# EAGLE schematic avocado_v2.0 (EAGLE 8.6.0)
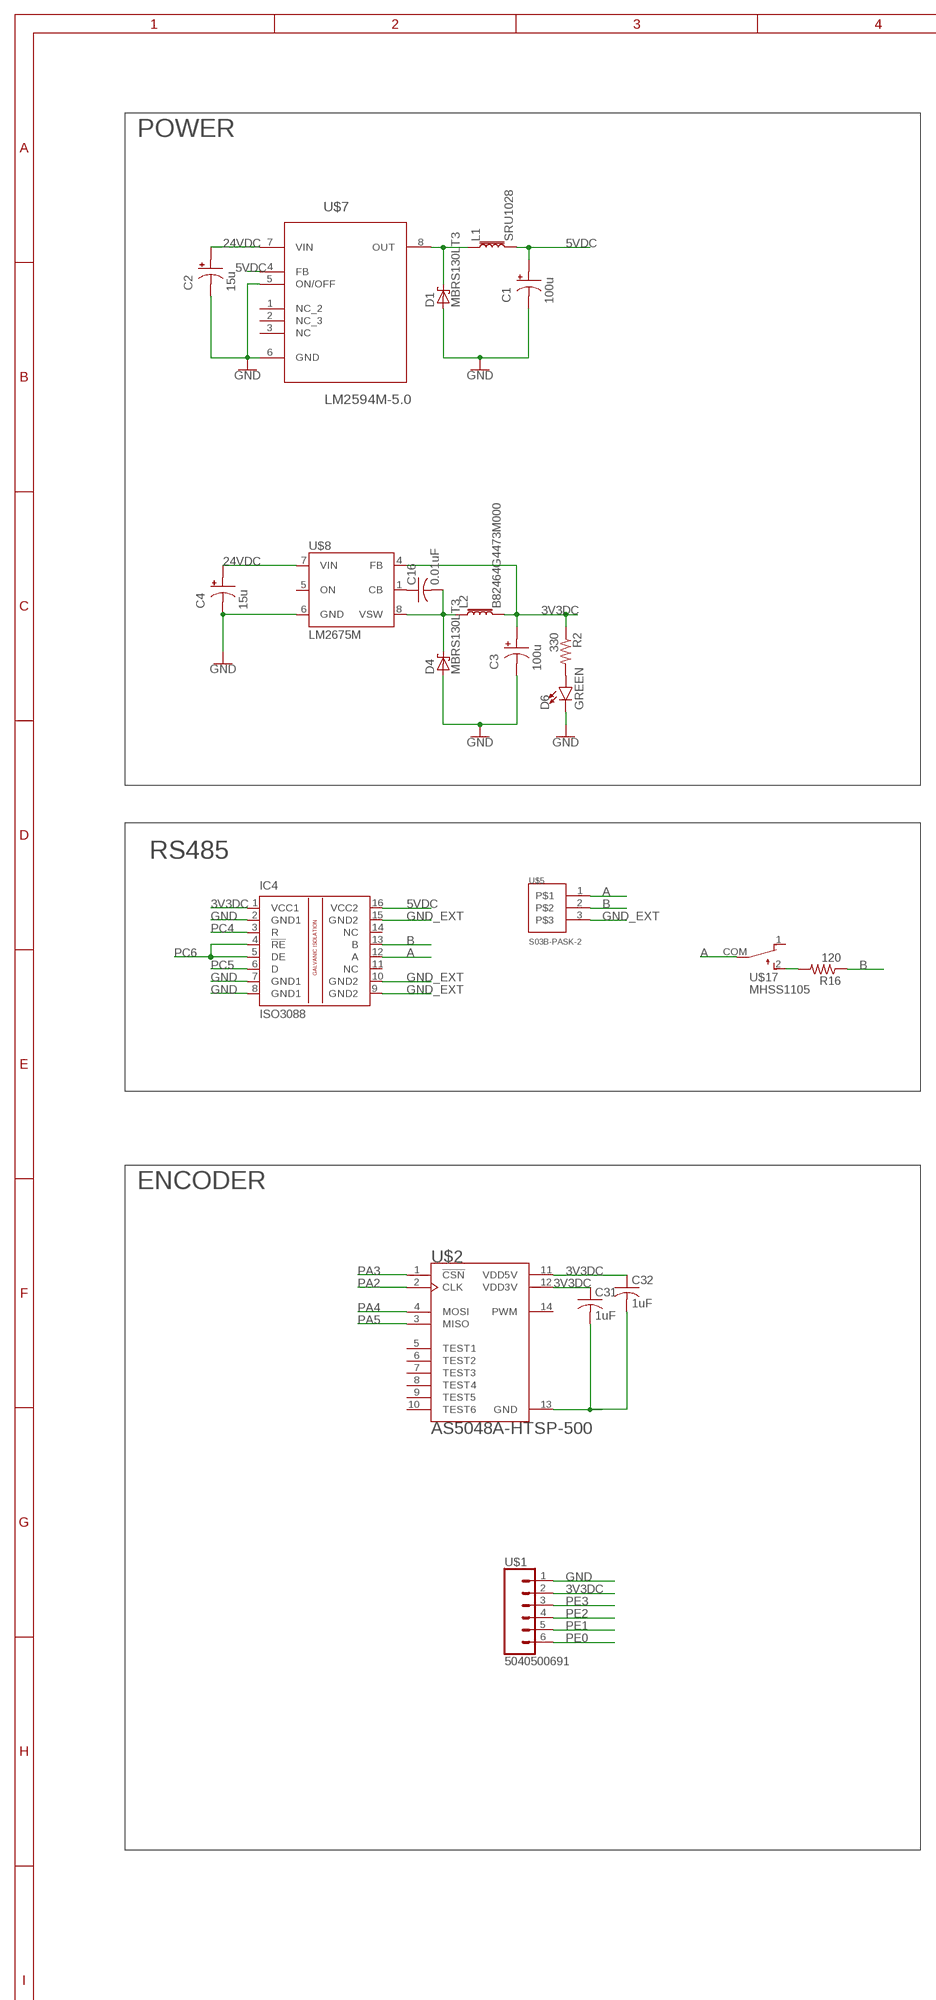
[diagram p0: schematic, sheet 1, part 1 of 2]
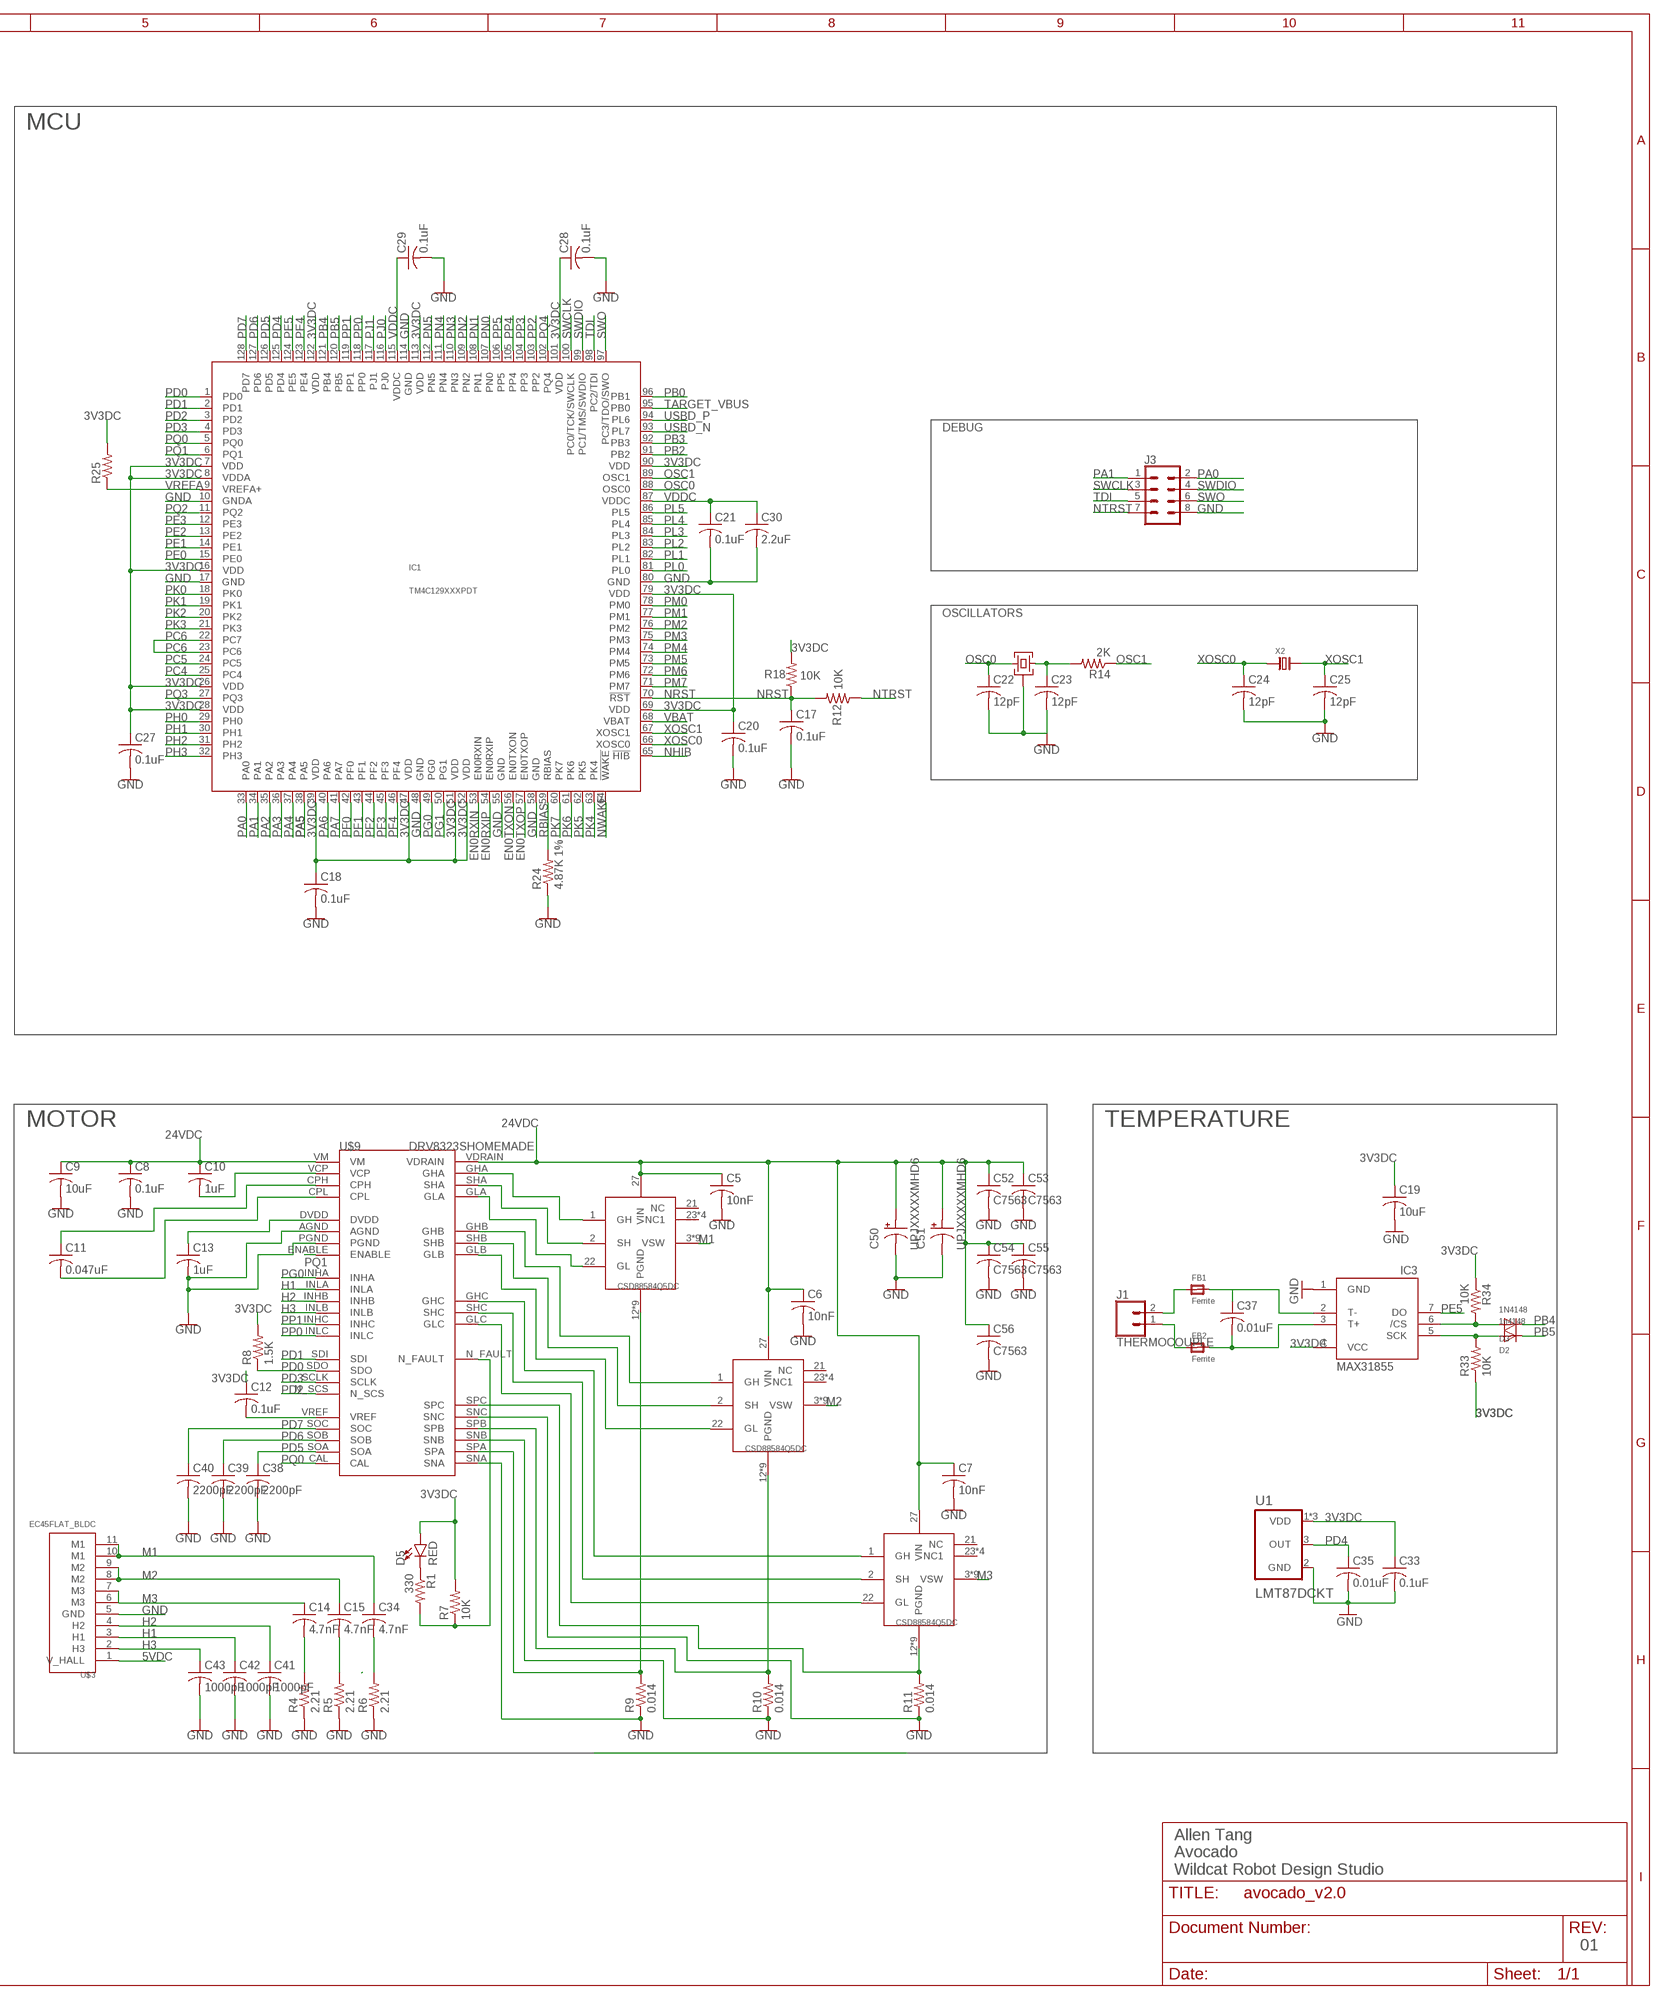
[diagram p1: schematic, sheet 1, part 2 of 2]

## Parts
C1  100u  AVX_TPS_CAPD  [2917-D]
C2  15u  AVX_TPS_CAPD  [2917-D]
C3  100u  AVX_TPS_CAPD  [2917-D]
C4  15u  AVX_TPS_CAPD  [2917-D]
C5  10nF  C-USC0402  [C0402]
C6  10nF  C-USC0402  [C0402]
C7  10nF  C-USC0402  [C0402]
C8  0.1uF  C-USC0402  [C0402]
C9  10uF  C-USC0805  [C0805]
C10  1uF  C-USC0805  [C0805]
C11  0.047uF  C-USC0402  [C0402]
C12  0.1uF  C-USC0402  [C0402]
C13  1uF  C-USC0402  [C0402]
C14  4.7nF  C-USC0402  [C0402]
C15  4.7nF  C-USC0402  [C0402]
C16  0.01uF  C-USC0402  [C0402]
C17  0.1uF  C-USC0402  [C0402]
C18  0.1uF  C-USC0402  [C0402]
C19  10uF  C-USC0402  [C0402]
C20  0.1uF  C-USC0402  [C0402]
C21  0.1uF  C-USC0402  [C0402]
C22  12pF  C-USC0402  [C0402]
C23  12pF  C-USC0402  [C0402]
C24  12pF  C-USC0402  [C0402]
C25  12pF  C-USC0402  [C0402]
C27  0.1uF  C-USC0402  [C0402]
C28  0.1uF  C-USC0402  [C0402]
C29  0.1uF  C-USC0402  [C0402]
C30  2.2uF  C-USC0402  [C0402]
C31  1uF  C-USC0805  [C0805]
C32  1uF  C-USC0805  [C0805]
C33  0.1uF  C-USC0402  [C0402]
C34  4.7nF  C-USC0402  [C0402]
C35  0.01uF  C-USC0402  [C0402]
C37  0.01uF  C-USC0402  [C0402]
C38  2200pF  C-USC0402  [C0402]
C39  2200pF  C-USC0402  [C0402]
C40  2200pF  C-USC0402  [C0402]
C41  1000pF  C-USC0402  [C0402]
C42  1000pF  C-USC0402  [C0402]
C43  1000pF  C-USC0402  [C0402]
C50  UPJXXXXXMHD6  [UPJXXXXXMHD6]
C51  UPJXXXXXMHD6  [UPJXXXXXMHD6]
C52  C7563  [3025]
C53  C7563  [3025]
C54  C7563  [3025]
C55  C7563  [3025]
C56  C7563  [3025]
D1  MBRS130LT3  [SMB]
D2  1n4148  DIODESOD-323F  [SOD-323F]
D3  1N4148  DIODESOD-323F  [SOD-323F]
D4  MBRS130LT3  [SMB]
D5  RED  LED-RED0603  [LED-0603]
D6  GREEN  LED-GREEN0603  [LED-0603]
FB1  Ferrite  FERRITE_0805  [_0805]
FB2  Ferrite  FERRITE_0805  [_0805]
IC1  TM4C129XXXPDT  [PDT_S-PQFP-G128]
IC3  MAX31855  MAX6675  [SO08]
IC4  ISO3088  [SOIC16]
J1  THERMOCOUPLE  [2_SMP]
J3  CONN_04X2  [2X4]
L1  SRU1028  [SRU1028]
L2  B82464G4473M000  [B82464G4473M000]
R1  330  R-US_R0402  [R0402]
R2  330  R-US_R0402  [R0402]
R4  2.21  R-US_R0805  [R0805]
R5  2.21  R-US_R0805  [R0805]
R6  2.21  R-US_R0805  [R0805]
R7  10K  R-US_R0402  [R0402]
R8  1.5K  R-US_R0402  [R0402]
R9  0.014  R-US_R2512  [R2512]
R10  0.014  R-US_R2512  [R2512]
R11  0.014  R-US_R2512  [R2512]
R12  10K  R-US_R0402  [R0402]
R14  2K  R-US_R0402  [R0402]
R16  120  R-US_R0805  [R0805]
R18  10K  R-US_R0402  [R0402]
R24  4.87K 1%  R-US_R0402  [R0402]
R25  R-US_R0402  [R0402]
R33  10K  R-US_R0402  [R0402]
R34  10K  R-US_R0402  [R0402]
U1  LMT87DCKT  [SOT65P210X110-5N]
U$1  5040500691  [5040500691]
U$2  AS5048A-HTSP-500  [SOP65P640X120-14N]
U$3  EC45FLAT_BLDC  [1MM-FPC-11PIN]
U$4  NX3225GA  [NX3225GA]
U$5  S03B-PASK-2  [S03B-PASK-2]
U$7  LM2594M-5.0  [SOIC127P620X175-8N]
U$8  LM2675M  [SO08]
U$9  DRV8323SHOMEMADE  [DRV8323S]
U$10  CSD88584Q5DC  [MOSFET_CSD88599Q5DC]
U$11  CSD88584Q5DC  [MOSFET_CSD88599Q5DC]
U$12  CSD88584Q5DC  [MOSFET_CSD88599Q5DC]
U$17  MHSS1105  [MHSS1105]
X2  CRYSTAL-ABS07  [ABRACON-ABS07-32.768KHZ]

## Nets
3V3DC: C3.+(A) C12.1 C18.1 C19.1 C20.1 C27.1 C28.1 C31.1 C32.1 C33.1 D5.A IC1.7(VDD) IC1.8(VDDA) IC1.16(VDD) IC1.26(VDD) IC1.28(VDD) IC1.39(VDD) IC1.47(VDD) IC1.51(VDD) IC1.52(VDD) IC1.69(VDD) IC1.79(VDD) IC1.90(VDD) IC1.101(VDD) IC1.113(VDD) IC1.122(VDD) IC3.4(VCC) IC4.1(VCC1) L2.2 R2.1 R7.2 R8.2 R18.2 R25.2 R33.1 R34.1 U1.1(VDD) U1.4(VDD) U1.5(VDD) U$1.2 U$2.11(VDD5V) U$2.12(VDD3V) U$8.4(FB)
5VDC: C1.+(A) IC4.16(VCC2) L1.2 U$3.1(V_HALL) U$7.4(FB)
24VDC: C2.+(A) C4.+(A) C5.1 C6.1 C7.1 C8.1 C9.1 C10.1 C50.+(A) C51.+(A) C52.P$1 C53.P$1 C54.P$1 C55.P$1 C56.P$1 U$7.7(VIN) U$8.7(VIN) U$9.VDRAIN U$9.VM U$10.27(VIN) U$11.27(VIN) U$12.27(VIN)
A: IC4.12(A) U$5.1 U$17.COM
B: IC4.13(B) R16.1 U$5.2
CS: D3.A IC3.6(/CS) R34.2
DVDD: C13.1 U$9.DVDD
EN0RXIN: IC1.53(EN0RXIN)
EN0RXIP: IC1.54(EN0RXIP)
EN0TXON: IC1.56(EN0TXON)
EN0TXOP: IC1.57(EN0TXOP)
GH1: U$9.GHA U$12.1(GH)
GH2: U$9.GHB U$11.1(GH)
GH3: U$9.GHC U$10.1(GH)
GL1: U$9.GLA U$12.22(GL)
GL2: U$9.GLB U$11.22(GL)
GL3: U$9.GLC U$10.22(GL)
GND: C1.-(C) C2.-(C) C3.-(C) C4.-(C) C5.2 C6.2 C7.2 C8.2 C9.2 C13.2 C17.2 C18.2 C19.2 C20.2 C21.2 C23.2 C24.2 C25.2 C27.2 C28.2 C29.2 C30.2 C31.2 C32.2 C33.2 C35.2 C38.2 C39.2 C40.2 C41.2 C42.2 C43.2 C50.-(C) C51.-(C) C52.P$2 C53.P$2 C54.P$2 C55.P$2 C56.P$2 D1.A D4.A D6.C IC1.10(GNDA) IC1.17(GND) IC1.48(GND) IC1.55(GND) IC1.58(GND) IC1.80(GND) IC1.114(GND) IC3.1(GND) IC4.2(GND1) IC4.7(GND1) IC4.8(GND1) J3.8 R4.1 R5.1 R6.1 R9.1 R10.1 R11.1 R24.1 U1.2(GND) U$1.1 U$2.13(GND) U$3.5(GND) U$7.5(ON/OFF) U$7.6(GND) U$8.6(GND) U$9.AGND U$9.PGND U$9.SNA U$9.SNB U$9.SNC
GND_EXT: IC4.9(GND2) IC4.10(GND2) IC4.15(GND2) U$5.3
H1: C42.1 U$3.3(H1) U$9.INLA
H2: C41.1 U$3.4(H2) U$9.INHB
H3: C43.1 U$3.2(H3) U$9.INLB
ISENS1: R9.2 U$9.SPA U$12.12(PGND) U$12.13(PGND) U$12.14(PGND) U$12.15(PGND) U$12.16(PGND) U$12.17(PGND) U$12.18(PGND) U$12.19(PGND) U$12.20(PGND)
ISENS2: R10.2 U$9.SPB U$11.12(PGND) U$11.13(PGND) U$11.14(PGND) U$11.15(PGND) U$11.16(PGND) U$11.17(PGND) U$11.18(PGND) U$11.19(PGND) U$11.20(PGND)
ISENS3: R11.2 U$9.SPC U$10.12(PGND) U$10.13(PGND) U$10.14(PGND) U$10.15(PGND) U$10.16(PGND) U$10.17(PGND) U$10.18(PGND) U$10.19(PGND) U$10.20(PGND)
M1: C34.1 U$3.10(M1) U$3.11(M1) U$12.3(VSW) U$12.4(VSW) U$12.5(VSW) U$12.6(VSW) U$12.7(VSW) U$12.8(VSW) U$12.9(VSW) U$12.10(VSW) U$12.11(VSW)
M2: C15.1 U$3.8(M2) U$3.9(M2) U$11.3(VSW) U$11.4(VSW) U$11.5(VSW) U$11.6(VSW) U$11.7(VSW) U$11.8(VSW) U$11.9(VSW) U$11.10(VSW) U$11.11(VSW)
M3: C14.1 U$3.6(M3) U$3.7(M3) U$10.3(VSW) U$10.4(VSW) U$10.5(VSW) U$10.6(VSW) U$10.7(VSW) U$10.8(VSW) U$10.9(VSW) U$10.10(VSW) U$10.11(VSW)
N$1: C34.2 R6.2
N$2: C10.2 U$9.VCP
N$3: C11.1 U$9.CPH
N$4: C16.1 U$8.1(CB)
N$6: C11.2 U$9.CPL
N$7: D6.A R2.2
N$8: D5.C R1.1
N$13: FB1.1 J1.2
N$15: C37.1 FB1.2 IC3.2(T-)
N$16: FB2.1 J1.1
N$17: C37.2 FB2.2 IC3.3(T+)
N$22: C12.2 U$9.VREF
N$23: R16.2 U$17.2
N$24: D1.C L1.1 U$7.8(OUT)
N$25: C16.2 D4.C L2.1 U$8.8(VSW)
N$40: C14.2 R4.2
N$41: C15.2 R5.2
N$42: C22.2 U$4.P$2 U$4.P$4
N$45: C23.1 R14.2 U$4.P$3
NFAULT: R1.2 R7.1 U$9.N_FAULT
NHIB: IC1.65(!HIB)
NRST: C17.1 IC1.70(!RST) R12.2 R18.1
NTRST: J3.7 R12.1
NWAKE: IC1.64(!WAKE)
OSC0: C22.1 IC1.88(OSC0) U$4.P$1
OSC1: IC1.89(OSC1) R14.1
PA0: IC1.33(PA0) J3.2
PA1: IC1.34(PA1) J3.1
PA2: IC1.35(PA2) U$2.2(CLK)
PA3: IC1.36(PA3) U$2.1(!CSN)
PA4: IC1.37(PA4) U$2.4(MOSI)
PA5: IC1.38(PA5) U$2.3(MISO)
PA6: IC1.40(PA6)
PA7: IC1.41(PA7)
PB0: IC1.96(PB1)
PB2: IC1.91(PB2)
PB3: IC1.92(PB3)
PB4: D3.C IC1.121(PB4)
PB5: D2.C IC1.120(PB5)
PC4: IC1.25(PC4) IC4.3(R)
PC5: IC1.24(PC5) IC4.6(D)
PC6: IC1.22(PC7) IC1.23(PC6) IC4.4(!RE) IC4.5(DE)
PD0: IC1.1(PD0) R8.1 U$9.SDO
PD1: IC1.2(PD1) U$9.SDI
PD2: IC1.3(PD2) U$9.N_SCS
PD3: IC1.4(PD3) U$9.SCLK
PD4: C35.1 IC1.125(PD4) U1.3(OUT)
PD5: C38.1 IC1.126(PD5) U$9.SOA
PD6: C39.1 IC1.127(PD6) U$9.SOB
PD7: C40.1 IC1.128(PD7) U$9.SOC
PE0: IC1.15(PE0) U$1.6
PE1: IC1.14(PE1) U$1.5
PE2: IC1.13(PE2) U$1.4
PE3: IC1.12(PE3) U$1.3
PE4: IC1.123(PE4)
PE5: IC1.124(PE5) IC3.7(DO)
PF0: IC1.42(PF0)
PF1: IC1.43(PF1)
PF2: IC1.44(PF2)
PF3: IC1.45(PF3)
PF4: IC1.46(PF4)
PG0: IC1.49(PG0) U$9.INHA
PG1: IC1.50(PG1)
PH0: IC1.29(PH0)
PH1: IC1.30(PH1)
PH2: IC1.31(PH2)
PH3: IC1.32(PH3)
PJ0: IC1.116(PJ0)
PJ1: IC1.117(PJ1)
PK0: IC1.18(PK0)
PK1: IC1.19(PK1)
PK2: IC1.20(PK2)
PK3: IC1.21(PK3)
PK4: IC1.63(PK4)
PK5: IC1.62(PK5)
PK6: IC1.61(PK6)
PK7: IC1.60(PK7)
PL0: IC1.81(PL0)
PL1: IC1.82(PL1)
PL2: IC1.83(PL2)
PL3: IC1.84(PL3)
PL4: IC1.85(PL4)
PL5: IC1.86(PL5)
PM0: IC1.78(PM0)
PM1: IC1.77(PM1)
PM2: IC1.76(PM2)
PM3: IC1.75(PM3)
PM4: IC1.74(PM4)
PM5: IC1.73(PM5)
PM6: IC1.72(PM6)
PM7: IC1.71(PM7)
PN0: IC1.107(PN0)
PN1: IC1.108(PN1)
PN2: IC1.109(PN2)
PN3: IC1.110(PN3)
PN4: IC1.111(PN4)
PN5: IC1.112(PN5)
PP0: IC1.118(PP0) U$9.INLC
PP1: IC1.119(PP1) U$9.INHC
PP2: IC1.103(PP2)
PP3: IC1.104(PP3)
PP4: IC1.105(PP4)
PP5: IC1.106(PP5)
PQ0: IC1.5(PQ0) U$9.CAL
PQ1: IC1.6(PQ1) U$9.ENABLE
PQ2: IC1.11(PQ2)
PQ3: IC1.27(PQ3)
PQ4: IC1.102(PQ4)
RBIAS: IC1.59(RBIAS) R24.2
SCK: D2.A IC3.5(SCK) R33.2
SH1: U$9.SHA U$12.2(SH)
SH2: U$9.SHB U$11.2(SH)
SH3: U$9.SHC U$10.2(SH)
SWCLK: IC1.100(PC0/TCK/SWCLK) J3.3
SWDIO: IC1.99(PC1/TMS/SWDIO) J3.4
SWO: IC1.97(PC3/TDO/SWO) J3.6
TARGET_VBUS: IC1.95(PB0)
TDI: IC1.98(PC2/TDI) J3.5
USBD_N: IC1.93(PL7)
USBD_P: IC1.94(PL6)
VBAT: IC1.68(VBAT)
VDDC: C21.1 C29.1 C30.1 IC1.87(VDDC) IC1.115(VDDC)
VREFA: IC1.9(VREFA+) R25.1
XOSC0: C24.1 IC1.66(XOSC0) X2.P$1
XOSC1: C25.1 IC1.67(XOSC1) X2.P$2
Unconnected: IC4.11(NC) IC4.14(NC) U$2.5(TEST1) U$2.6(TEST2) U$2.7(TEST3) U$2.8(TEST4) U$2.9(TEST5) U$2.10(TEST6) U$2.14(PWM) U$7.1(NC_2) U$7.2(NC_3) U$7.3(NC) U$8.5(ON) U$10.21(NC) U$10.23(NC1) U$10.24(NC1) U$10.25(NC1) U$10.26(NC1) U$11.21(NC) U$11.23(NC1) U$11.24(NC1) U$11.25(NC1) U$11.26(NC1) U$12.21(NC) U$12.23(NC1) U$12.24(NC1) U$12.25(NC1) U$12.26(NC1) U$17.1

## Notes on the sheet
- POWER | MCU
- DEBUG
- OSCILLATORS
- RS485
- ENCODER | MOTOR | TEMPERATURE
- Allen Tang
  Avocado
  Wildcat Robot Design Studio
- 01

## Library data of the parts
C1-C4 = avocado:AVX_TPS_CAP: Tantalum Surface Mount Capacitor - Standard Tantalum
C5-C25 C27-C35 C37-C43 = rcl:C-US: CAPACITOR, American symbol; SPICEPREFIX: C
C50 C51 = avocado:UPJXXXXXMHD6: Aluminum Electrolytic Capacitor
C52-C56 = avocado:C7563: 22uF, 50V, Ceramic Capacitor, TDK
D1 D4 = avocado:MBRS130LT3: Schottky Power Rectifier Source: http://www.onsemi.com/pub/Collateral/MBRS130LT3-D.PDF
D2 D3 = adafruit:DIODE: Diode SMADIODE - SMA Surface Mount Package 20V 1A Schottky Diode Digikey: 641-1014-6-ND DO-1N4148 - Through Hole Small Current Diode SOD-123 20V 1 A (.5mV Vf) Schottky Diode - Digikey: MBRX120TPMSCT-ND SOD-323 10V 570mA (.38mV Vf, 3ns) Schottky Diode - Digikey: ZLLS410CT-ND SOD-523 30V 30mA Schottky Diode (RB751S-40TE61) - Digikey: RB751S-40TE61CT-ND SOT23-R/W - SOT23 Package (R = Solder Paste/Reflow Ovens, W = Hand-Soldering) BAT54Film 40V 300mA - Digikey: 497-7162-1-ND
D5 = SparkFun-LED:LED-RED: Red SMD LED Used in manufacturing of most products at SparkFun Packages: 0603 - SMD 0603 package [Product Link] <http://docs.avagotech.com/docs/AV02-0551EN> 0603 SMART - SMD 0603 SMART package ( more efficient and expensive)[Product Link] <http://www.osram-os.com/Graphics/XPic2/00077099_0.pdf> 1206 - SMD1206 package [Product Link] <https://www.sparkfun.com/datasheets/DevTools/LilyPad/Q150OVS4.pdff> SparkFun Products: Pro Mini 328 -5V <https://www.sparkfun.com/products/821> RedBoard <https://www.sparkfun.com/products/12757> IOIO-OTG <https://www.sparkfun.com/products/13613>; PROD_ID: DIO-00819
D6 = SparkFun-LED:LED-GREEN: Green SMD LED Used in manufacturing of various products at SparkFun Packages: 0603 - SMD 0603 package [Product Link] <http://www.futureelectronics.com/en/technologies/semiconductors/optoelectronics/leds/Pages/9894312-LTST-C190GKT.aspx?CrossPart=HSMG-C190&IM=0> LilyPad 1206 - SMD1206 LilyPad package [Product Link] <http://www.futureelectronics.com/en/Technologies/Product.aspx?ProductID=IN150NGHARVATEKCORPORATION2049943&IM=0> 1206 - SMD1206 package [Product Link] <http://www.futureelectronics.com/en/technologies/semiconductors/optoelectronics/leds/Pages/8315665-LTST-C150KGKT.aspx?IM=0> 1206 Bottom Mount -SMD 1206 Bottom Mount [Product Link] <http://www.digikey.com/product-detail/en/lite-on-inc/LTST-C230KGKT/160-1456-1-ND/386854> SparkFun Products: Pro Mini 328 -5V <https://www.sparkfun.com/products/821> RedBoard <https://www.sparkfun.com/products/12757> MP3 Trigger <https://www.sparkfun.com/products/13720> Makey Makey <https://www.sparkfun.com/products/11076>; PROD_ID: DIO-00821
FB1 FB2 = microbuilder:FERRITE: Ferrite Bead 0603 MMZ1608B121C - 120 Ohm @ 100MHz, 600mA, 0.15 Ohm DC Resistance - Digikey: 445-2164-1-ND BK1608HW121-T - 120 Ohm, 600mA Ferrite Chip - Digikey: 587-1876-2-ND 0805 HZ0805B272R-10 - 2.7K Ohm @ 100MHz, 200mA, 0.8 Ohm DC Resistance - Digikey: 240-2504-1-ND (see also Murata BLM21BD272SN1L) MMZ2012Y152B - 1.5K Ohm @ 100MHz, 500mA, 0.4 Ohm DC Resistance - Digikey: 445-1560-1-ND - Mainly for high frequency (80-400MHz) MMZ2012R102A - 1K Ohm @ 100MHz, 500mA, 0.3 Ohm DC Resistance - Digikey: 445-1555-2-ND - More general purpose (10-200MHz)
IC1 = avocado:TM4C129XXX
IC3 = adafruit:MAX6675
IC4 = avocado:ISO3088: ISOLATED RS-485 TRANSCEIVER HALF-DUPLEX
J1 = avocado:THERMOCOUPLE
J3 = SparkFun-Connectors:CONN_04X2: Multi connection point. Often used as Generic Header-pin footprint for 0.1 inch spaced/style header connections On any of the 0.1 inch spaced packages, you can populate with these: Break Away Headers - Straight <https://www.sparkfun.com/products/116> (PRT-00116) Break Away Male Headers - Right Angle <https://www.sparkfun.com/products/553> (PRT-00553) Female Headers <https://www.sparkfun.com/products/115> (PRT-00115) Break Away Headers - Machine Pin <https://www.sparkfun.com/products/117> (PRT-00117) Break Away Female Headers - Swiss Machine Pin <https://www.sparkfun.com/products/743> (PRT-00743)
L1 = avocado:SRU1028: Bourns SRU1028 series inductor with ferrite core
L2 = avocado:B82464G4473M000: FIXED IND 47UH 1.55A 95 MOHM SMD
R1 R2 R4-R12 R14 R16 R18 R24 R25 = rcl:R-US_: RESISTOR, American symbol; SPICEPREFIX: R
R33 R34 = adafruit:R-US_: RESISTOR, American symbol
U1 = avocado:LMT87DCKT: SENSOR TEMP ANLG VOLT SC-70-5; DESCRIPTION: 2.7V-Capable, 10 uA Analog Output Temperature Sensor in SC70 and TO-92 5-SC70 -50 to 150; DIGI-KEY_PART_NUMBER: 296-35730-1-ND; DIGI-KEY_PURCHASE_URL: https://www.digikey.com/product-detail/en/texas-instruments/LMT87DCKT/296-35730-1-ND/3987165?WT.z_cid=ref_snapeda&utm_source=snapeda&utm_medium=aggregator&utm_campaign=buynow; MF: Texas Instruments; MP: LMT87DCKT; PACKAGE: SC-70-5 Texas Instruments
U$1 = avocado:5040500691: Molex Pico-Lock, 6POS, Surface Mount
U$2 = avocado:AS5048A-HTSP-500: AS5048A Series 360° 3.3 / 5 V 14 bit Magnetic Rotary Encoder - TSSOP-14; AVAILABILITY: Unavailable; DESCRIPTION: AS5048B Series 360° 3.3 / 5 V 14 bit Magnetic Rotary Encoder - TSSOP-14; MF: ams; MP: AS5048A-HTSP-500; PACKAGE: TSSOP-14 ams; PRICE: 7.10 USD
U$3 = avocado:EC45FLAT_BLDC
U$4 = avocado:NX3225GA: NX3225GA OSCILLATOR
U$5 = avocado:S03B-PASK-2: JST PA SERIES, 3 POS
U$7 = avocado:LM2594M-5.0: SIMPLE SWITCHER® Power Converter; AVAILABILITY: Unavailable; DESCRIPTION: Ic Lm2594/So/Lm2594m/-5.0 National Semi So8; MF: National Semiconductor; MP: LM2594M/-5.0; PACKAGE: SO-8 National Semiconductor; PRICE: 1.81 USD
U$8 = avocado:LM2675: National Semiconductor <http://www.national.com> 1.0A "Simple Switcher"(c) 260kHz, Vout 1.2-37V, Vin 40V, 250mOhm DMOS switch, 50µA standby current; AVAILABILITY: Unavailable; MF: National Semiconductor; MP: LM2675; PACKAGE: None; PRICE: None
U$9 = motor_control:DRV8323S
U$10-U$12 = CSD88584Q5DC:CSD88584Q5DC; AVAILABILITY: Good; DESCRIPTION: 40 V Half-Bridge NexFET Power Block 22-VSON-CLIP -55 to 150; MF: Texas Instruments; MP: CSD88584Q5DC; PACKAGE: VSON-22 Texas Instruments; PRICE: 3.37 USD
U$17 = avocado:MHSS1105: MHSS1105 Slide Switch
X2 = avocado:CRYSTAL